# EAGLE design BatteryCharger(I2C_V1) (EAGLE 6.5.0)
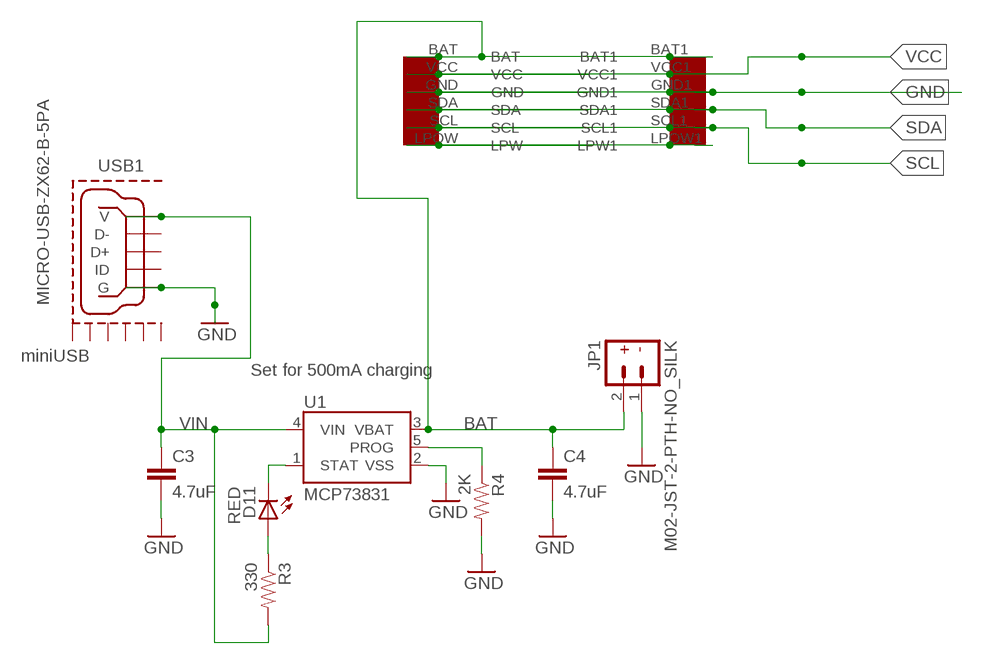
[diagram p0: schematic, sheet 1]

## Parts
C3  4.7uF  CAP0402-CAP  [0402-CAP]
C4  4.7uF  CAP0402-CAP  [0402-CAP]
D11  RED  LED0603  [LED-0603]
JP1  M02-JST-2-PTH-NO_SILK  [JST-2-PTH-NS]
R3  330  RESISTOR0402-RES  [0402-RES]
R4  2K  RESISTOR0402-RES  [0402-RES]
U1  MCP73831  [SOT23-5]
U$1  EZ-I2CHEADERV1  [EZ-I2CHEADERV1]
USB1  MICRO-USB-ZX62-B-5PA  [ZX62-B-5PA]

## Nets
BAT: C4.1 JP1.2 U1.3(VBAT) U$1.BAT U$1.BAT1
GND: C3.2 C4.2 JP1.1 R4.2 U1.2(VSS) U$1.GND U$1.GND1 USB1.5(G)
N$2: D11.A R3.1
N$3: U$1.LPOW1(LPW1) U$1.LPOW(LPW)
PROG: R4.1 U1.5(PROG)
SCL: U$1.SCL U$1.SCL1
SDA: U$1.SDA U$1.SDA1
STAT: D11.C U1.1(STAT)
VCC: U$1.VCC U$1.VCC1
VIN: C3.1 R3.2 U1.4(VIN) USB1.1(V)
Unconnected: USB1.2(D-) USB1.3(D+) USB1.4(ID)

## Notes on the sheet
- miniUSB
- Set for 500mA charging

## Power pins joined to a net without a drawn wire
GND1: USB1.GND@1(GND1)
GND2: USB1.GND@2(GND2)
GND3: USB1.GND@3(GND3)
GND4: USB1.GND@4(GND4)
GND5: USB1.GND@5(GND5)
GND6: USB1.GND@6(GND6)

## Library data of the parts
C3 C4 = SparkFun:CAP: Capacitor Standard 0603 ceramic capacitor, and 0.1" leaded capacitor.
D11 = SparkFun:LED: LEDs Standard schematic elements and footprints for 5mm, 3mm, 1206, and 0603 sized LEDs. 5mm - Spark Fun Electronics SKU : COM-00529 (and others)
JP1 = SparkFun-Connectors:M02: Standard 2-pin 0.1" header. Use with - straight break away headers ( PRT-00116) - right angle break away headers (PRT-00553) - swiss pins (PRT-00743) - machine pins (PRT-00117) - female headers (PRT-00115) Molex polarized connector foot print use with: PRT-08233 with associated crimp pins and housings. 2.54_SCREWTERM for use with PRT-10571. 3.5mm Screw Terminal footprints for PRT-08084 5mm Screw Terminal footprints for use with PRT-08433
R3 R4 = SparkFun:RESISTOR: Resistor Basic schematic elements and footprints for 0603, 1206, and PTH resistors.
U1 = SparkFun:MCP73831: Microchip's MCP73831 Miniature single cell, fully integrated Li-Ion, Li-polymer charge management controller http://ww1.microchip.com/downloads/en/DeviceDoc/21984a.pdf
U$1 = UniqueInteractionsLib:EZ-I2CHEADERV1
USB1 = serial:MICRO-USB: MICRO USB B, BOTTOM MOUNT

## Board
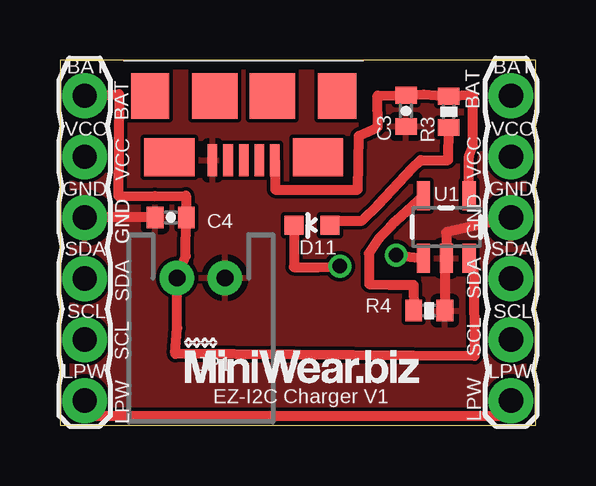
[diagram p1: board, top side]
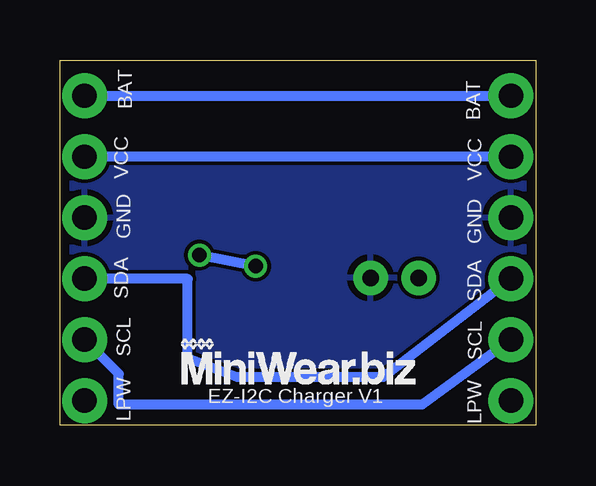
[diagram p2: board, bottom side, seen from below]

Size 19.83 x 15.21 mm. Coordinates in mm from the lower left corner, seen from the top.
Outline: 0,0 19.83,0 19.83,15.21 0,15.19 0,0
Copper layers (1*16): Top 0.0356mm / dielectric 1.5011mm / Bottom 0.0356mm
Design rules "oshParkPCBDesignRules": minimum track width 6mil, minimum drill 13mil, track to track 6mil, track to pad 6mil, pad to pad 6mil, via to via 6mil, smd to smd 6mil, copper to edge 15mil, drill to drill 6mil, minimum pad ring 7mil, minimum via ring 7mil, stop-mask expansion 3mil, vias tented up to drill 0mil, thermal gap 10mil

### Footprints (pad centres in the part's own frame; a part is rotated, then mirrored left to right if it is on the bottom)
0402-CAP = smd 0.7 x 0.9: 1 -0.65,0; 2 0.65,0
LED-0603 = smd 0.8 x 0.8: A 0,-0.75; C 0,0.75
JST-2-PTH-NS = drill 0.7 pad 1.448: 1 -1,0; 2 1,0
0402-RES = smd 0.7 x 0.9: 1 -0.65,0; 2 0.65,0
SOT23-5 = smd 0.55 x 1.2: 1 -0.95,-1.3; 2 0,-1.3; 3 0.95,-1.3; 4 0.95,1.3; 5 -0.95,1.3
EZ-I2CHEADERV1 = drill 1.016 pad 1.88: BAT 0,-1.27; BAT1 17.78,-1.27; GND 0,-6.35; GND1 17.78,-6.35; LPOW 0,-13.97; LPOW1 17.78,-13.97; SCL 0,-11.43; SCL1 17.78,-11.43; SDA 0,-8.89; SDA1 17.78,-8.89; VCC 0,-3.81; VCC1 17.78,-3.81
ZX62-B-5PA = smd 0.4 x 1.35: 1 -1.3,2.675; 2 -0.65,2.675; 3 0,2.675; 4 0.65,2.675; 5 1.3,2.675 | smd 2.1 x 1.6: GND@1 -3.1,2.55; GND@2 3.1,2.55 | smd 1.6 x 1.9: GND@3 3.9,0; GND@6 -3.9,0 | smd 1.9 x 1.9: GND@4 1.2,0; GND@5 -1.2,0

### Placement (x,y rotation side)
C3  14.43,13.09 270 top
C4  4.62,8.65 180 top
D11  10.51,8.32 90 top
JP1  5.88,6.13 180 top
R3  16.21,13.05 90 top
R4  15.4,4.77 0 top
U1  16.11,8.25 0 top
U$1  1.03,14.99 0 top
U$2  [LOGO2]  14.88,1.52 0 bottom
U$6  [LOGO2]  5.1,1.57 0 top
USB1  7.66,13.71 180 top

### Tracks (layer width: path | path; a pad name or v marks a point on that pad's centre or on a via)
BAT
  Top 0.406: U$1.BAT 2.46,13.79 2.43,9.55 3.95,9.54 5.26,9.56 C4.1 5.24,7.04 JP1.2 4.89,4.04 4.81,2.96 17.29,2.87 17.25,6.3 U1.3
  Bottom 0.406: U$1.BAT1 U$1.BAT
GND
  Top 0.406: C4.2 U$1.GND | U$1.GND1 16.11,8.03 U1.2 16.05,7.25 R4.2
  pour Top: 0.06,18.15 21.85,18.22 21.76,-3.2 -0.1,-3.04
  pour Bottom: -2.09,-1.08 22.72,-0.76 22.82,17.13 -1.85,17.14
N$2
  Top 0.406: D11.A 11.25,8.52 12.6,8.52 13.25,9.16 14.69,10.69 15.05,11.04 16.19,11.04 R3.1
N$3
  Top 0.406: U$1.LPOW1 18.81,0.37 0.94,0.37 0.94,1.02 U$1.LPOW
PROG
  Top 0.406: U1.5 13.99,8.49 13.73,8.21 13.31,7.78 12.88,7.15 12.89,5.87 13.75,5.84 14.74,5.84 R4.1
SCL
  Bottom 0.406: U$1.SCL 4.74,0.85 17.38,0.85 17.38,2.13 U$1.SCL1
SDA
  Bottom 0.406: U$1.SDA 6.36,2 12.44,2 14.52,2.79 14.51,6.09 14.62,6.1 U$1.SDA1
STAT  (via drill 0.6)
  Top 0.406: D11.C 9.77,7.18 9.76,6.58 10.76,6.57 v11.67,6.62 | v14.02,7.08 U1.1
  Bottom 0.406: v11.67,6.62 v14.02,7.08
VCC
  Bottom 0.406: U$1.VCC U$1.VCC1
VIN
  Top 0.406: U1.4 17.06,11.19 17.22,11.61 17.22,13.74 R3.2 15.17,13.78 C3.1 13.24,13.73 13.26,12.41 12.46,12.05 12.42,9.81 8.97,9.81 USB1.1

### Text on the board
tNames: EZ-I2C Charger V1
bNames: EZ-I2C Charger V1